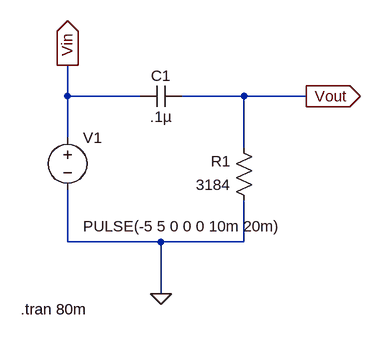
[diagram p0: schematic HighPass.asc]
HighPass.asc, the LTspice schematic file:
Version 4
SHEET 1 880 680
WIRE 32 80 32 32
WIRE 144 80 32 80
WIRE 304 80 208 80
WIRE 400 80 304 80
WIRE 32 144 32 80
WIRE 304 160 304 80
WIRE 32 304 32 224
WIRE 176 304 32 304
WIRE 304 304 304 240
WIRE 304 304 176 304
WIRE 176 384 176 304
FLAG 176 384 0
FLAG 400 80 Vout
IOPIN 400 80 Out
FLAG 32 32 Vin
IOPIN 32 32 Out
SYMBOL voltage 32 128 R0
WINDOW 3 24 152 Left 2
WINDOW 123 24 124 Left 2
WINDOW 39 0 0 Left 0
SYMATTR Value PULSE(-5 5 0 0 0 10m 20m)
SYMATTR InstName V1
SYMBOL res 320 256 R180
WINDOW 0 36 76 Left 2
WINDOW 3 36 40 Left 2
SYMATTR InstName R1
SYMATTR Value 3184
SYMBOL cap 208 64 R90
WINDOW 0 0 32 VBottom 2
WINDOW 3 32 32 VTop 2
SYMATTR InstName C1
SYMATTR Value .1µ
TEXT -40 408 Left 2 !.tran 80m

The netlist it stands for:
* HighPass.asc
V1 Vin 0 PULSE(-5 5 0 0 0 10m 20m)
R1 0 Vout 3184
C1 Vout Vin .1µ
.tran 80m
.backanno
.end